# EAGLE design pvinvertershield32_v2 (EAGLE 9.6.2)
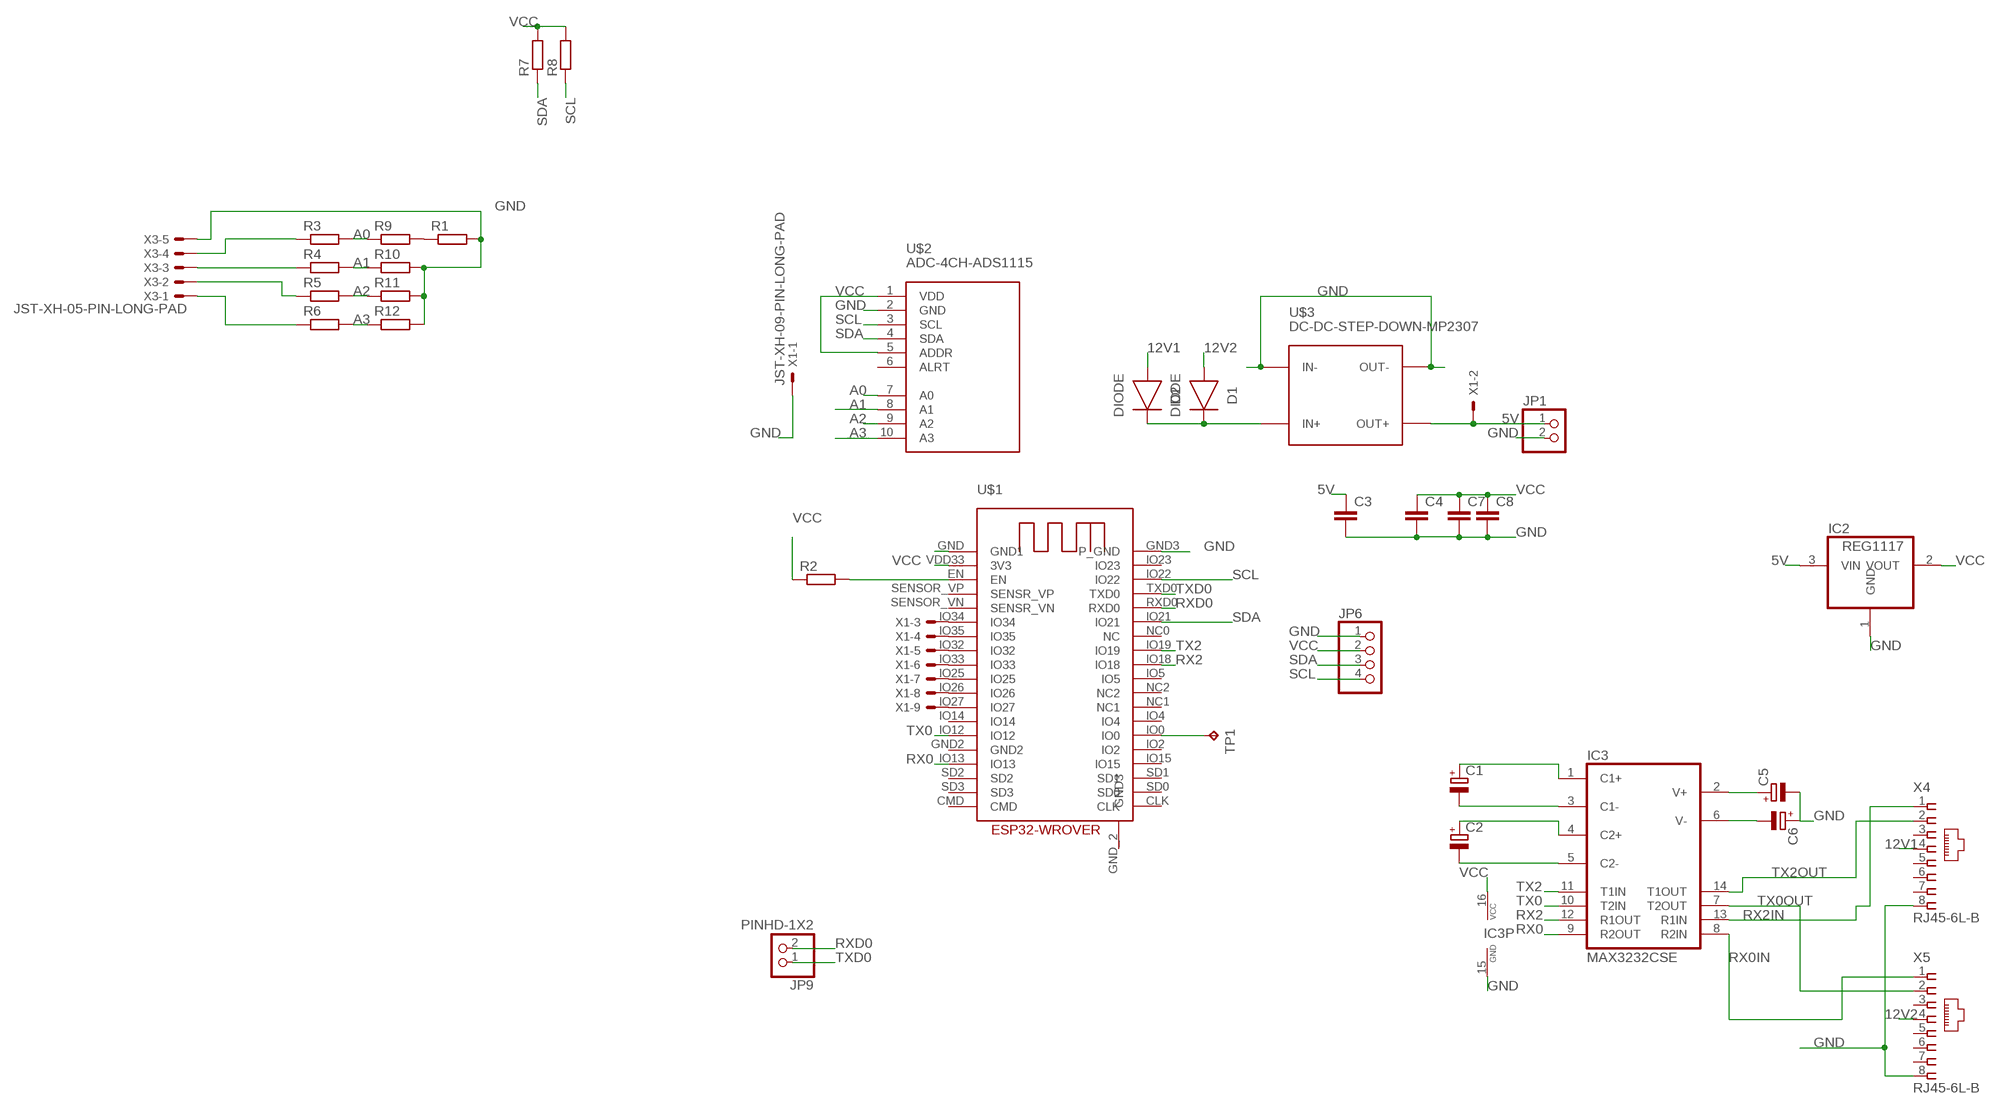
[diagram p0: schematic, sheet 1]

## Parts
C1  CPOL-EUE2.5-6  [E2,5-6]
C2  CPOL-EUE2.5-6  [E2,5-6]
C3  C-EUC1210  [C1210]
C4  C-EUC1210  [C1210]
C5  CPOL-EUE2.5-6  [E2,5-6]
C6  CPOL-EUE2.5-6  [E2,5-6]
C7  C-EUC1210  [C1210]
C8  C-EUC1210  [C1210]
D1  DIODE  DIODE_DO-213AB(5025-METRIC)  [DIOMELF5024]
D2  DIODE  DIODE_DO-213AB(5025-METRIC)  [DIOMELF5024]
IC2  REG1117  [SOT223]
IC3  MAX3232CSE  [SO16]
JP1  PINHD-1X2  [1X02]
JP6  PINHD-1X4  [1X04]
JP9  PINHD-1X2  [1X02]
R1  R-EU_R0805  [R0805]
R2  R-EU_R0805  [R0805]
R3  R-EU_R0805  [R0805]
R4  R-EU_R0805  [R0805]
R5  R-EU_R0805  [R0805]
R6  R-EU_R0805  [R0805]
R7  R-EU_0207/10  [0207/10]
R8  R-EU_0207/10  [0207/10]
R9  R-EU_R0805  [R0805]
R10  R-EU_R0805  [R0805]
R11  R-EU_R0805  [R0805]
R12  R-EU_R0805  [R0805]
TP1  TPB2,54  [B2,54]
U$1  ESP32-WROVER  [ESP32-WROVER]
U$2  ADC-4CH-ADS1115  [ADC-4CH-ADS1115]
U$3  DC-DC-STEP-DOWN-MP2307  [DC-DC-STEP-DOWN-MP2307]
X1  JST-XH-09-PIN-LONG-PAD  [JST-XH-09-PACKAGE-LONG-PAD]
X3  JST-XH-05-PIN-LONG-PAD  [JST-XH-05-PACKAGE-LONG-PAD]
X4  RJ45-6L-B  [RJ45-NO-SHIELD]
X5  RJ45-6L-B  [RJ45-NO-SHIELD]

## Nets
5V: C3.1 IC2.3(VIN) JP1.1 U$3.OUT+ X1.2
12V1: D2.2(A) X4.4
12V2: D1.2(A) X5.4
A0: R3.2 R9.1 U$2.7(A0)
A1: R4.2 R10.1 U$2.8(A1)
A2: R5.2 R11.1 U$2.9(A2)
A3: R6.2 R12.1 U$2.10(A3)
GND: C3.2 C4.2 C5.- C6.+ C7.2 C8.2 IC2.1(GND) IC3.15(GND) JP1.2 JP6.1 R1.2 R10.2 R11.2 R12.2 U$1.GND3(P_GND) U$1.GND(GND1) U$2.2(GND) U$3.IN- U$3.OUT- X1.1 X3.5 X4.8 X5.8
N$1: C1.+ IC3.1(C1+)
N$2: C1.- IC3.3(C1-)
N$3: C2.+ IC3.4(C2+)
N$4: C2.- IC3.5(C2-)
N$5: C5.+ IC3.2(V+)
N$6: C6.- IC3.6(V-)
N$7: D1.1(C) D2.1(C) U$3.IN+
N$8: U$1.IO34 X1.3
N$9: R1.1 R9.2
N$10: U$1.IO35 X1.4
N$11: R3.1 X3.4
N$12: R4.1 X3.3
N$13: U$1.IO32 X1.5
N$14: R2.2 U$1.EN
N$15: U$1.IO33 X1.6
N$16: U$1.IO25 X1.7
N$17: U$1.IO26 X1.8
N$18: R5.1 X3.2
N$19: R6.1 X3.1
N$20: U$1.IO27 X1.9
N$23: TP1.TP U$1.IO0
RX0: IC3.9(R2OUT) U$1.IO13
RX0IN: IC3.8(R2IN) X5.1
RX2: IC3.12(R1OUT) U$1.IO18
RX2IN: IC3.13(R1IN) X4.1
RXD0: JP9.2 U$1.RXD0
SCL: JP6.4 R8.1 U$1.IO22 U$2.3(SCL)
SDA: JP6.3 R7.1 U$1.IO21 U$2.4(SDA)
TX0: IC3.10(T2IN) U$1.IO12
TX0OUT: IC3.7(T2OUT) X5.2
TX2: IC3.11(T1IN) U$1.IO19
TX2OUT: IC3.14(T1OUT) X4.2
TXD0: JP9.1 U$1.TXD0
VCC: C4.1 C7.1 C8.1 IC2.2(VOUT) IC3.16(VCC) JP6.2 R2.1 R7.2 R8.2 U$1.VDD33(3V3) U$2.1(VDD) U$2.5(ADDR)
Unconnected: U$1.CLK U$1.CMD U$1.GND2 U$1.GND_2(GND3) U$1.IO2 U$1.IO4 U$1.IO5 U$1.IO14 U$1.IO15 U$1.IO23 U$1.NC0(NC) U$1.NC1 U$1.NC2 U$1.SD0 U$1.SD1 U$1.SD2 U$1.SD3 U$1.SENSOR_VN(SENSR_VN) U$1.SENSOR_VP(SENSR_VP) U$2.6(ALRT) X4.3 X4.5 X4.6 X4.7 X5.3 X5.5 X5.6 X5.7

## Library data of the parts
C1 C2 C5 C6 = rcl:CPOL-EU: POLARIZED CAPACITOR, European symbol; SPICEPREFIX: C
C3 C4 C7 C8 = rcl:C-EU: CAPACITOR, European symbol; SPICEPREFIX: C
D1 D2 = Diode:DIODE: Diode Rectifier - Generic; CATEGORY: Diode; SUB-CATEGORY: Rectifier
IC2 = burr-brown:REG1117: 800mA and 1A Low Dropout (LDO) Positive Regulator 1.8V, 2.5V, 2.85V, 3.3V, 5V, and Adj; MPN: REG1117; OC_FARNELL: 1097566; OC_NEWARK: 14P6981
IC3 = maxim:MAX3232*: True RS-232 Transceivers 3.0V to 5.5V, Low-Power up to 1Mbps, Using Four 0.1µF External Capacitors Source: http://pdfserv.maxim-ic.com/en/ds/MAX3222-MAX3241.pdf; MPN: MAX3232CSE; OC_FARNELL: 9725490; OC_NEWARK: 90C2890
JP1 = pinhead:PINHD-1X2: PIN HEADER
JP6 = pinhead:PINHD-1X4: PIN HEADER
JP9 = Connector:PINHD-1X2: PIN HEADER; CATEGORY: CONNECTOR; SUB-CATEGORY: PIN-HEADER
R1 R3-R12 = resistor:R-EU_: RESISTOR, European symbol
R2 = rcl:R-EU_: RESISTOR, European symbol; SPICEPREFIX: R
TP1 = testpad:TP: Test pad
U$1 = 32teeth - ESP32-WROVER:ESP32-WROVER
U$2 = diy-modules:ADC-4CH-ADS1115: 4 Channel 16-Bit Analog-to-Digital Converter based on ADS1115 chip Arduino ADS1115 Getting Started Tutorial is available here: http://henrysbench.capnfatz.com/henrys-bench/arduino-voltage-measurements/arduino-ads1115-module-getting-started-tutorial/ ADS1115 datasheet is available here: http://www.ti.com/lit/ds/symlink/ads1115.pdf Click here to find device on ebay.com <http://www.ebay.com/sch/ads1115+module>
U$3 = diy-modules:DC-DC-STEP-DOWN-MP2307: DC/DC Step-Down Regulator based on MP2307DN chip MP2307 datasheet available here: https://cdn-shop.adafruit.com/datasheets/MP2307_r1.9.pdf Click here to find device on ebay.com <http://www.ebay.com/sch/dc+dc+3a+mini+converter>
X1 = Rembrandt Electronics - JST XH Connectors v1-0:JST-XH-09-PIN: JST XH Connector 2 Pin Wire to board connector. Pitch: 2,54 mm, (0.100") Number of pins: 9 Created by Rembrandt Electronics www.rembrandtelectronics.com
X3 = Rembrandt Electronics - JST XH Connectors v1-0:JST-XH-05-PIN: JST XH Connector 2 Pin Wire to board connector. Pitch: 2,54 mm, (0.100") Number of pins: 5 Created by Rembrandt Electronics www.rembrandtelectronics.com
X4 X5 = con-tycoelectronics:RJ45: CORCOM Modular RJ Jacks No Shield Source: www.tycoelectronics.com .. ENG_DS_1654001_1099_RJ_L_0507.pdf; MPN: RJ45-6L-B; OC_FARNELL: unknown; OC_NEWARK: 16R6090

## Board
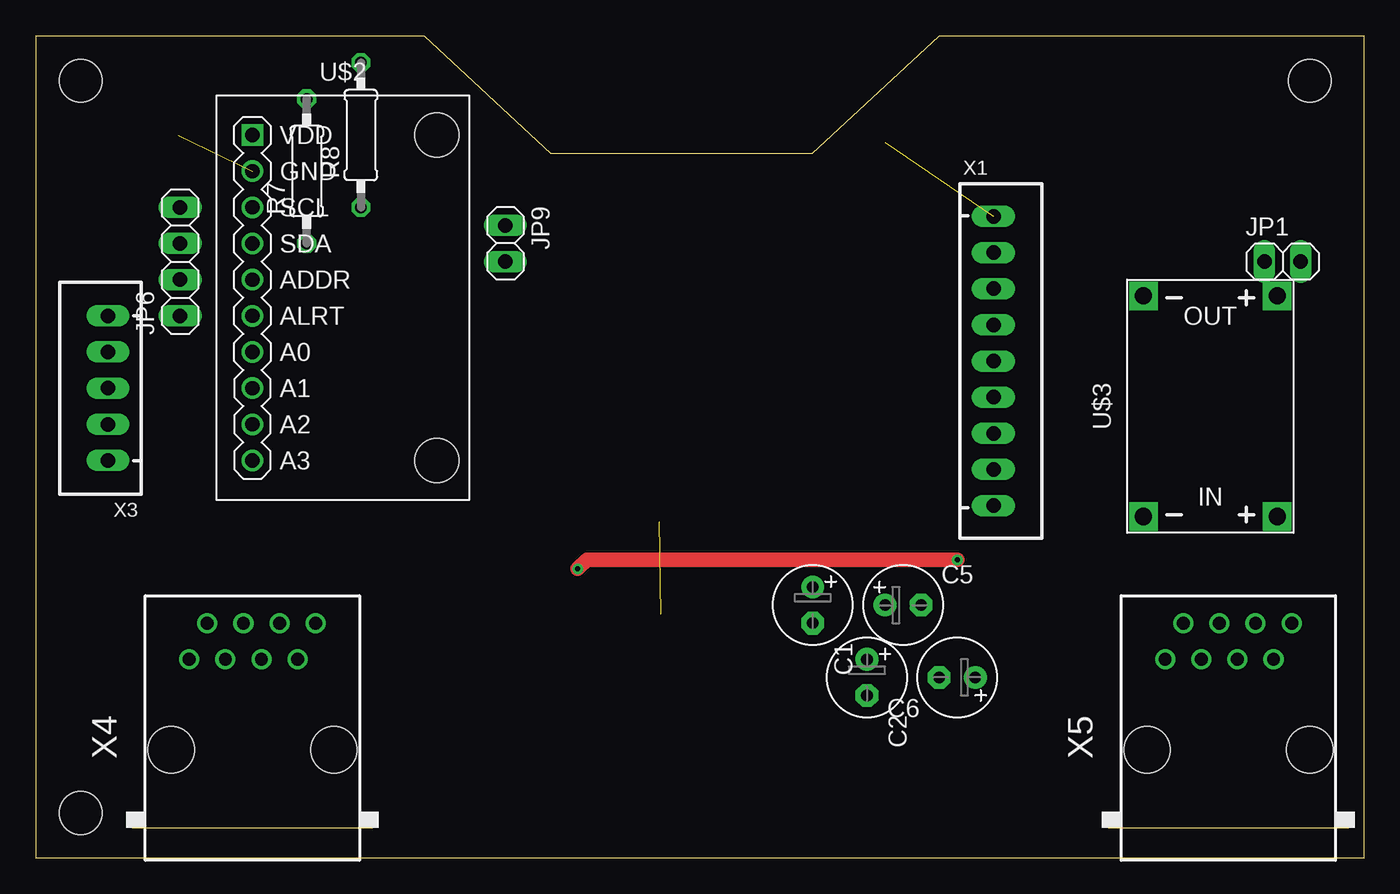
[diagram p1: board, top side]
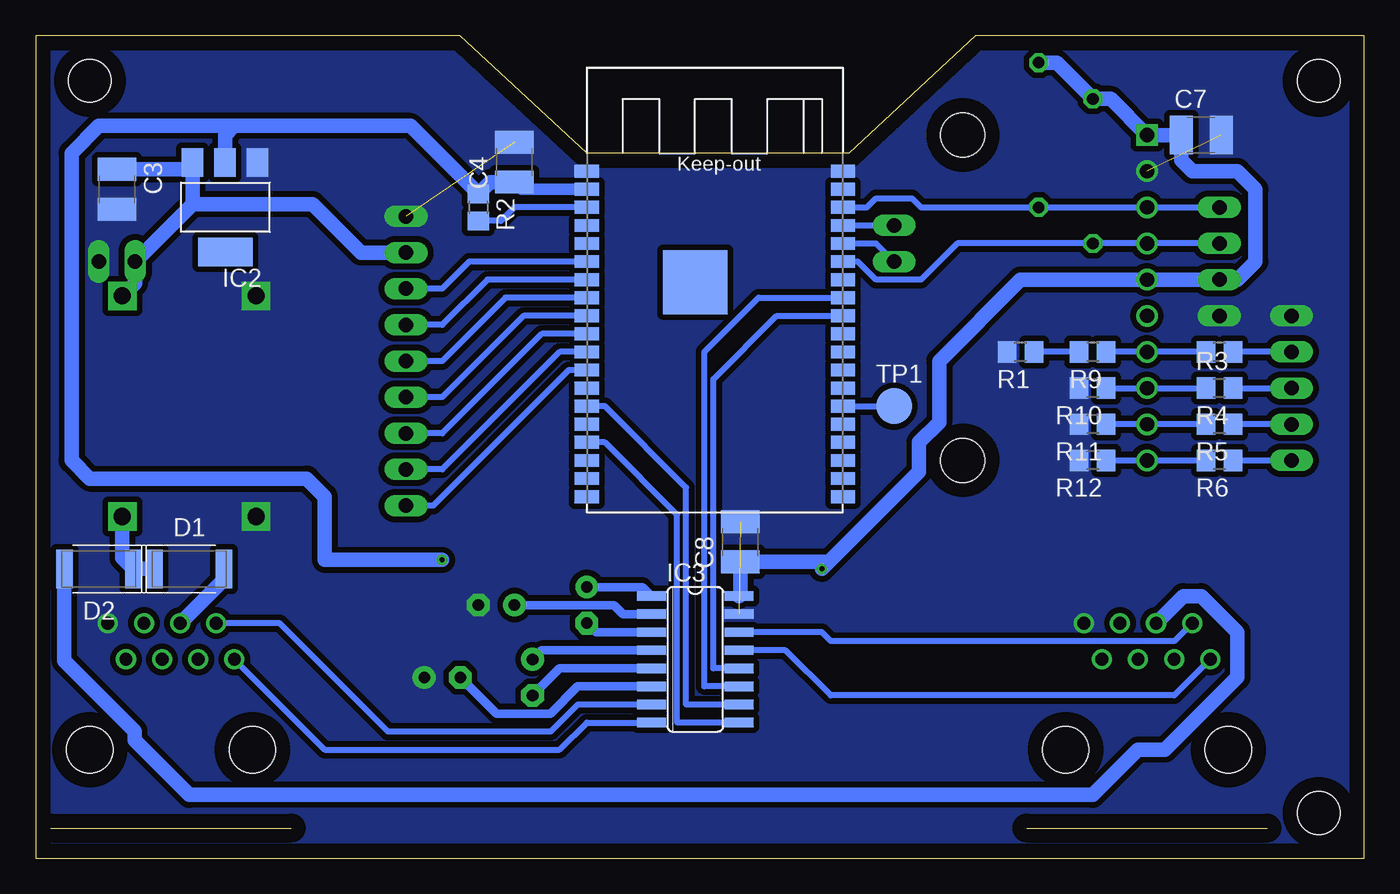
[diagram p2: board, bottom side, seen from below]

Size 93.34 x 57.78 mm. Coordinates in mm from the lower left corner, seen from the top.
Outline: 0,57.77 0,0 93.34,0 93.34,57.78 63.5,57.78 54.61,49.53 36.2,49.53 27.3,57.78 0,57.78
Copper layers (1*16): Top 0.035mm / dielectric 1.5mm / Bottom 0.035mm
Design rules "default *": minimum track width 6mil, minimum drill 0.35mm, track to track 16mil, track to pad 16mil, pad to pad 16mil, via to via 16mil, smd to smd 6mil, copper to edge 40mil, drill to drill 6mil, minimum pad ring 10mil, minimum via ring 8mil, stop-mask expansion 4mil, vias tented up to drill 0mil, thermal gap 0mil
Holes 3 mm at 3.17,54.61 3.17,3.17 89.53,54.61

### Footprints (pad centres in the part's own frame; a part is rotated, then mirrored left to right if it is on the bottom)
E2,5-6 = drill 0.813 pad 1.6: + -1.27,0 | drill 0.813 pad 1.6 octagon: - 1.27,0
C1210 = smd 1.6 x 2.7: 1 -1.4,0; 2 1.4,0
DIOMELF5024 = smd 1.156 x 2.69: 1 -2.43,0; 2 2.43,0
SOT223 = smd 1.499 x 2.007: 1 -2.261,-3.15; 2 0.025,-3.15; 3 2.311,-3.15 | smd 3.81 x 2.007: 4 0,3.15
SO16 = smd 0.66 x 2.032: 1 -4.445,-3.073; 2 -3.175,-3.073; 3 -1.905,-3.073; 4 -0.635,-3.073; 5 0.635,-3.073; 6 1.905,-3.073; 7 3.175,-3.073; 8 4.445,-3.073; 9 4.445,3.073; 10 3.175,3.073; 11 1.905,3.073; 12 0.635,3.073; 13 -0.635,3.073; 14 -1.905,3.073; 15 -3.175,3.073; 16 -4.445,3.073
1X02 = drill 1.016 long: 1 -1.27,0; 2 1.27,0
1X04 = drill 1.016 long: 1 -3.81,0; 2 -1.27,0; 3 1.27,0; 4 3.81,0
R0805 = smd 1.3 x 1.5: 1 -0.95,0; 2 0.95,0
0207/10 = drill 0.813 octagon: 1 -5.08,0; 2 5.08,0
B2,54 = smd 2.54 x 2.54: TP 0,0
ESP32-WROVER = smd 1.7 x 0.9: CLK 18,1.27; CMD 0,1.27; EN 0,21.59; GND 0,24.13; GND3 18,24.13; GND_2 0,6.35; IO0 18,7.62; IO2 18,6.35; IO4 18,8.89; IO5 18,12.7; IO12 0,7.62; IO13 0,5.08; IO14 0,8.89; IO15 18,5.08; IO18 18,13.97; IO19 18,15.24; IO21 18,17.78; IO22 18,21.59; IO23 18,22.86; IO25 0,12.7; IO26 0,11.43; IO27 0,10.16; IO32 0,15.24; IO33 0,13.97; IO34 0,17.78; IO35 0,16.51; NC0 18,16.51; NC1 18,10.16; NC2 18,11.43; RXD0 18,19.05; SD0 18,2.54; SD1 18,3.81; SD2 0,3.81; SD3 0,2.54; SENSOR_VN 0,19.05; SENSOR_VP 0,20.32; TXD0 18,20.32; VDD33 0,22.86 | smd 4.5 x 4.5: GND2 7.62,16.34
ADC-4CH-ADS1115 = drill 1 square: 1 -6.35,11.43 | drill 1: 2 -6.35,8.89; 3 -6.35,6.35; 4 -6.35,3.81; 5 -6.35,1.27; 6 -6.35,-1.27; 7 -6.35,-3.81; 8 -6.35,-6.35; 9 -6.35,-8.89; 10 -6.35,-11.43 | hole 3.1: 6.604,11.43; 6.604,-11.43
DC-DC-STEP-DOWN-MP2307 = drill 1.2 pad 2 square: IN+ -7.747,-4.699; IN- -7.747,4.699; OUT+ 7.747,-4.699; OUT- 7.747,4.699
JST-XH-09-PACKAGE-LONG-PAD = drill 1.016 long: 1 -10.16,0; 2 -7.62,0; 3 -5.08,0; 4 -2.54,0; 5 0,0; 6 2.54,0; 7 5.08,0; 8 7.62,0; 9 10.16,0
JST-XH-05-PACKAGE-LONG-PAD = drill 1.016 long: 1 -5.08,0; 2 -2.54,0; 3 0,0; 4 2.54,0; 5 5.08,0
RJ45-NO-SHIELD = drill 0.9 pad 1.4: 1 -4.445,6.35; 2 -3.175,8.89; 3 -1.905,6.35; 4 -0.635,8.89; 5 0.635,6.35; 6 1.905,8.89; 7 3.175,6.35; 8 4.445,8.89 | hole 3.251: -5.715,0; 5.715,0

### Placement (x,y rotation side)
C1  54.61,17.78 270 top
C2  58.42,12.7 270 top
C3  87.63,46.99 270 bottom
C4  59.69,48.9 90 bottom
C5  60.96,17.78 0 top
C6  64.77,12.7 180 top
C7  11.43,50.8 0 bottom
C8  43.81,22.23 90 bottom
D1  82.55,20.32 0 bottom
D2  88.9,20.32 180 bottom
IC2  80.01,45.72 180 bottom
IC3  46.99,13.97 270 bottom
JP1  87.63,41.91 0 top
JP6  10.16,41.91 90 top
JP9  33.02,43.18 270 top
R1  24.13,35.56 180 bottom
R2  62.23,45.72 270 bottom
R3  10.16,35.56 180 bottom
R4  10.16,33.02 180 bottom
R5  10.16,30.48 180 bottom
R6  10.16,27.94 180 bottom
R7  19.05,48.26 90 top
R8  22.86,50.8 90 top
R9  19.05,35.56 180 bottom
R10  19.05,33.02 180 bottom
R11  19.05,30.48 180 bottom
R12  19.05,27.94 180 bottom
TP1  33.02,31.75 0 bottom
U$1  54.61,24.13 0 bottom
U$2  21.59,39.37 0 top
U$3  82.55,31.75 90 top
X1  67.31,34.92 270 top
X3  5.08,33.02 90 top
X4  15.24,7.62 0 top
X5  83.82,7.62 0 top

### Tracks (layer width: path | path; a pad name or v marks a point on that pad's centre or on a via)
5V
  Bottom 1.016: U$3.OUT+ 86.36,40.39 JP1.1 82.32,45.95 | 82.32,45.95 IC2.3 82.8,48.39 C3.1 | 82.32,45.95 73.89,45.95 70.48,42.55 X1.2
12V1
  Bottom 1.016: X4.4 12.7,18.41 11.43,18.41 8.89,15.88 8.89,12.7 10.82,10.77 10.83,10.77 13.98,7.62 15.88,7.62 19.05,4.45 82.55,4.45 86.39,8.28 86.39,8.93 91.33,13.87 D2.2
12V2
  Bottom 1.016: X5.4 80.12,19.57 D1.2
A0
  Bottom 0.406: R3.2 U$2.7 R9.1
A1
  Bottom 0.406: R10.1 U$2.8 R4.2
A2
  Bottom 0.406: R5.2 U$2.9 R11.1
A3
  Bottom 0.406: R12.1 U$2.10 R6.2
GND  (3 unrouted)
  pour Bottom: 0,0 0,57.78 27.3,57.78 35.56,49.53 55.24,49.53 63.5,57.78 93.34,57.78 93.34,0
N$1
  Bottom 0.61: IC3.1 50.7,19.05 C1.+
N$2
  Bottom 0.61: IC3.3 53.98,15.88 C1.-
N$3
  Bottom 0.61: IC3.4 57.78,14.61 C2.+
N$4
  Bottom 0.61: C2.- 56.52,13.34 IC3.5
N$5
  Bottom 0.61: C5.+ 52.7,17.78 52.07,17.14 IC3.2
N$6
  Bottom 0.61: IC3.6 55.24,12.06 57.15,10.16 60.96,10.16 C6.-
N$7
  Bottom 1.016: D1.1 D2.1 87.25,21.1 U$3.IN+
N$8
  Bottom 0.406: U$1.IO34 62.87,41.91 64.77,40.01 X1.3
N$9
  Bottom 0.406: R9.2 R1.1
N$10
  Bottom 0.406: U$1.IO35 61.59,40.64 64.77,37.47 X1.4
N$11
  Bottom 0.406: X3.4 R3.1
N$12
  Bottom 0.406: R4.1 X3.3
N$13
  Bottom 0.406: U$1.IO32 60.33,39.37 64.77,34.92 X1.5
N$14
  Bottom 0.406: U$1.EN 59.69,45.72 60.64,44.77 R2.2
N$15
  Bottom 0.406: U$1.IO33 59.05,38.1 64.77,32.38 X1.6
N$16
  Bottom 0.406: U$1.IO25 57.78,36.83 64.77,29.84 X1.7
N$17
  Bottom 0.406: U$1.IO26 56.52,35.56 64.77,27.3 X1.8
N$18
  Bottom 0.406: X3.2 R5.1
N$19
  Bottom 0.406: R6.1 X3.1
N$20
  Bottom 0.406: U$1.IO27 55.88,34.29 65.41,24.77 X1.9
N$23
  Bottom 0.406: U$1.IO0 TP1.TP
RX0
  Bottom 0.406: IC3.9 48.26,9.53 48.26,24.13 53.34,29.21 U$1.IO13
RX0IN
  Bottom 0.406: IC3.8 54.61,9.53 56.52,7.62 73.03,7.62 X5.1
RX2
  Bottom 0.406: IC3.12 45.72,13.34 45.72,33.66 41.27,38.1 U$1.IO18
RX2IN
  Bottom 0.406: X4.1 13.34,11.43 37.47,11.43 40.64,14.61 IC3.13
RXD0
  Bottom 0.406: JP9.2 34.29,43.18 U$1.RXD0
SCL
  Bottom 0.406: U$1.IO22 34.92,45.72 34.29,46.35 31.75,46.35 31.11,45.72 R8.1 U$2.3 JP6.4
SDA
  Bottom 0.406: JP6.3 U$2.4 R7.1 28.57,43.18 31.11,40.64 34.29,40.64 35.56,41.91 U$1.IO21
TX0
  Bottom 0.406: IC3.10 47.62,10.79 47.62,26.04 53.34,31.75 U$1.IO12
TX0OUT
  Bottom 0.406: IC3.7 55.24,10.79 57.15,8.89 68.58,8.89 76.2,16.51 X5.2
TX2
  Bottom 0.406: IC3.11 46.35,12.06 46.35,35.56 42.55,39.37 U$1.IO19
TX2OUT
  Bottom 0.406: X4.2 13.34,15.24 37.47,15.24 38.1,15.88 IC3.14
TXD0
  Bottom 0.406: U$1.TXD0 JP9.1
VCC  (via drill 0.35)
  Top 1.016: v64.77,20.95 38.73,20.95 v38.1,20.32
  Bottom 0.813: U$1.VDD33 59.19,46.99 C4.1
  Bottom 1.016: R8.2 21.59,55.88 R7.2 17.78,53.34 U$2.1 C7.1 12.83,49.02 12.06,48.26 8.89,48.26 7.62,46.99 7.62,41.91 8.89,40.64 JP6.2 U$2.5 24.13,40.64 29.84,34.92 29.84,30.64 31.27,29.21 31.27,27.15 37.59,20.82 | 37.59,20.82 C8.1 43.81,18.52 IC3.16 | C4.1 61.41,47.49 R2.1 67,51.44 79.38,51.44 | 79.38,51.44 80.03,50.77 IC2.2 | 79.38,51.44 88.9,51.44 90.81,49.53 90.81,27.94 89.53,26.67 74.3,26.67 73.03,25.4 73.03,20.95 v64.77,20.95 | v38.1,20.32 37.59,20.82